# Altium schematic sheet STM32f042_schematic.SchDoc: Nucleo-STM32F042K6 Shield
size Letter; Organization: Ram Rohit Gannavarapu; Address1: Graduate Research Assistant; Address2: Systems Engineering Dept.; Address3: Colorado State University; Address4: Fort Collins, CO 80521; DocumentNumber: CAN |  ATECC608 | PWM; Revision: 1; SheetNumber: 1; SheetTotal: 1
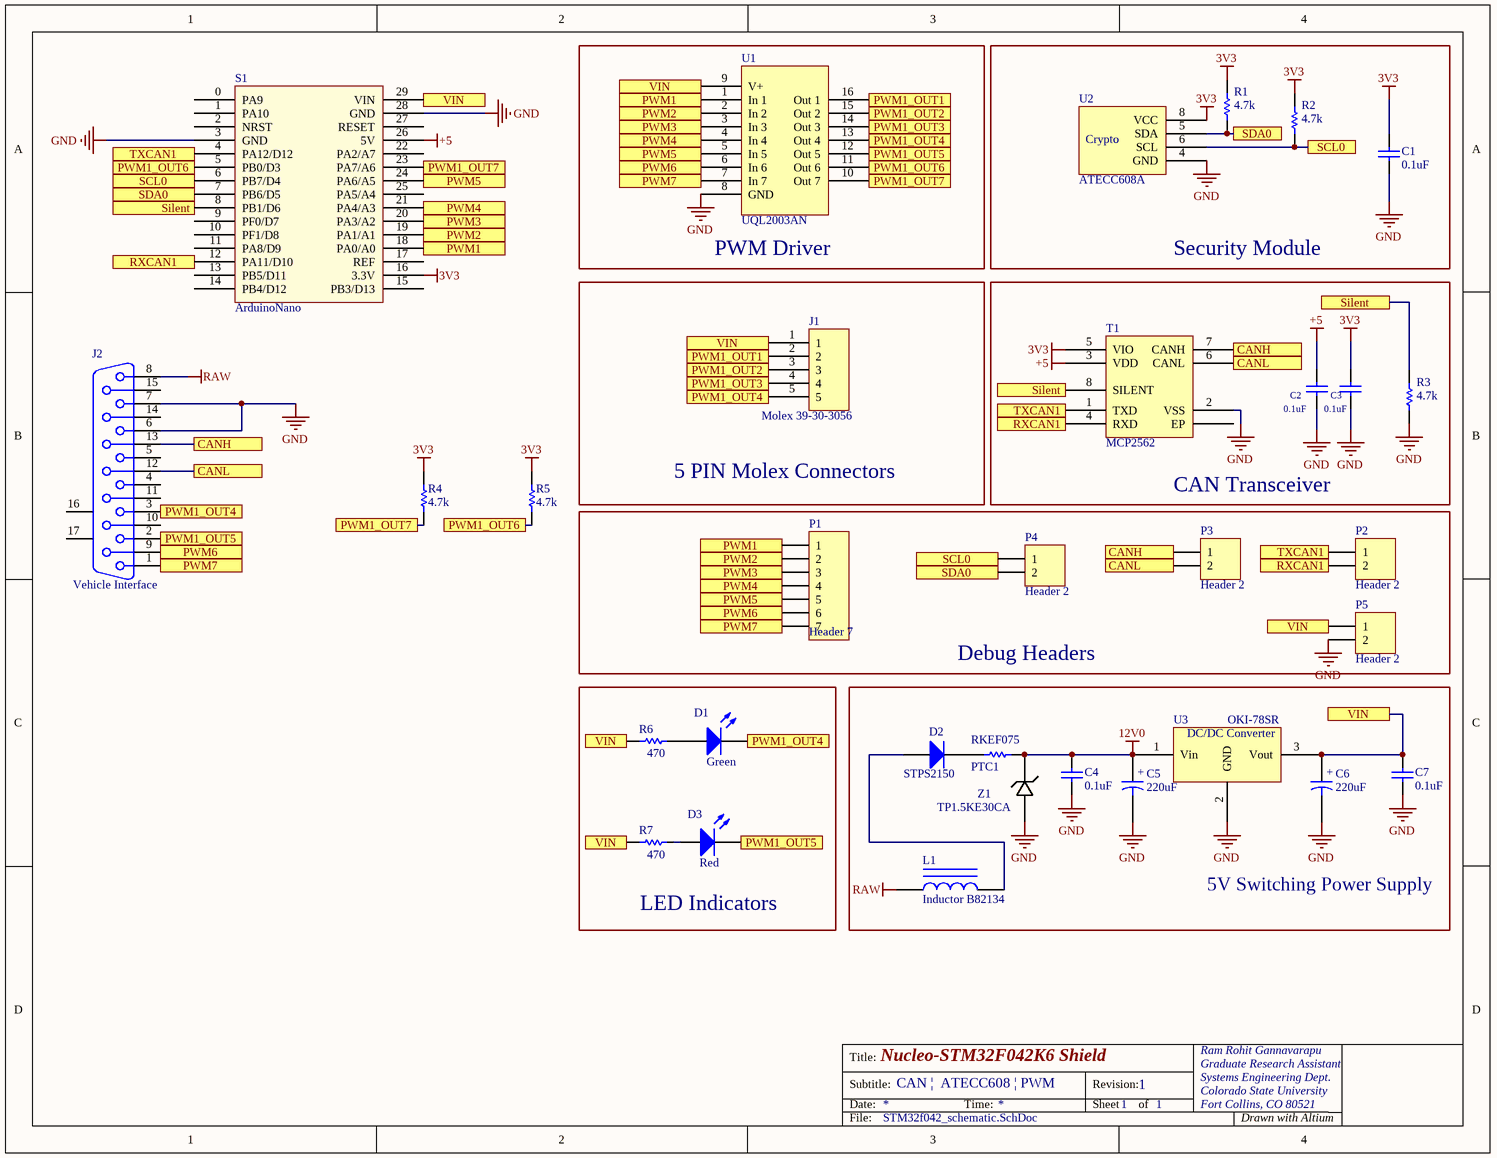
[diagram p0: STM32f042_schematic.SchDoc]

## Parts
C1  0.1uF  [CAPR5-4X5]
C2  0.1uF  [CAPR5-4X5]
C3  0.1uF  [CAPR5-4X5]
C4  0.1uF  [CAPR5-4X5]
C5  220uF  [Elec. Cap 5 x 10mm]
C6  220uF  [Elec. Cap 5 x 10mm]
C7  0.1uF  [CAPR5-4X5]
D1  Green  [5mm Rad LED]
D2  STPS2150  [DO-41]
D3  Red  [5mm Rad LED]
J1  Molex 39-30-3056  [5 POS MINI-FIT JR R/A Header]
J2  Vehicle Interface  [DB15]
L1  Inductor B82134  [AXIAL-0.9]
P1  Header 7  [HDR1X7]
P2  Header 2  [HDR1X2]
P3  Header 2  [HDR1X2]
P4  Header 2  [HDR1X2]
P5  Header 2  [HDR1X2]
PTC1  RKEF075  [PTC]
R1  4.7k  [AXIAL-0.4]
R2  4.7k  [AXIAL-0.4]
R3  4.7k  [AXIAL-0.4]
R4  4.7k  [Axial-0.4]
R5  4.7k  [Axial-0.4]
R6  470  [AXIAL-0.4]
R7  470  [AXIAL-0.4]
S1  ArduinoNano  [Arduino nano]
T1  MCP2562  [DIP-8]
U1  UQL2003AN  [DIP16]
U2  ATECC608A  [SOIC-8]
U3  OKI-78SR  [OKI-78SR]
Z1  TP1.5KE30CA  [DIODE-0.7]

## Blocks framed on the sheet
PWM Driver: U1
Security Module: C1 R1 R2 U2
5 PIN Molex Connectors: J1
CAN Transceiver: C2 C3 R3 T1
Debug Headers: P1-P5
LED Indicators: D1 D3 R6 R7
5V Switching Power Supply: C4-C7 D2 L1 PTC1 U3 Z1

## Ports
CANH, CANL, PWM1, PWM1_OUT1, PWM1_OUT2, PWM1_OUT3, PWM1_OUT4, PWM1_OUT5, PWM1_OUT6, PWM1_OUT7, PWM2, PWM3, PWM4, PWM5, PWM6, PWM7, RXCAN1, SCL0, SDA0, Silent, TXCAN1, VIN

## Nets
3V3: C1.2 C3.2 R1.1 R2.1 R4.2 R5.2 S1.16(3.3V) T1.5(VIO) U2.8(VCC)
12V0: C4.2 C5.1 PTC1.2 U3.1(Vin) Z1.2(K)
+5: C2.2 S1.26(5V) T1.3(VDD)
GND: C1.1 C2.1 C3.1 C4.1 C5.2(-) C6.2(-) C7.1 J2.6 J2.7 P5.2 R3.2 S1.3(GND) S1.28(GND) T1.2(VSS) U1.8(GND) U2.4(GND) U3.2(GND) Z1.1(A)
RAW: J2.8 L1.1
CANH: J2.13 P3.1 T1.7(CANH) ; port CANH
CANL: J2.12 P3.2 T1.6(CANL) ; port CANL
PWM1: P1.1 S1.18(PA0/A0) U1.1(In_1) ; port PWM1
PWM1_OUT1: J1.2 U1.16(Out_1) ; port PWM1_OUT1
PWM1_OUT2: J1.3 U1.15(Out_2) ; port PWM1_OUT2
PWM1_OUT3: J1.4 U1.14(Out_3) ; port PWM1_OUT3
PWM1_OUT4: D1.2(K) J1.5 J2.3 U1.13(Out_4) ; port PWM1_OUT4
PWM1_OUT5: D3.2(K) J2.2 U1.12(Out_5) ; port PWM1_OUT5
PWM1_OUT6: R5.1 S1.5(PB0/D3) U1.11(Out_6) ; port PWM1_OUT6
PWM1_OUT7: R4.1 S1.23(PA7/A6) U1.10(Out_7) ; port PWM1_OUT7
PWM2: P1.2 S1.19(PA1/A1) U1.2(In_2) ; port PWM2
PWM3: P1.3 S1.20(PA3/A2) U1.3(In_3) ; port PWM3
PWM4: P1.4 S1.21(PA4/A3) U1.4(In_4) ; port PWM4
PWM5: P1.5 S1.24(PA6/A5) U1.5(In_5) ; port PWM5
PWM6: J2.9 P1.6 U1.6(In_6) ; port PWM6
PWM7: J2.1 P1.7 U1.7(In_7) ; port PWM7
RXCAN1: P2.2 S1.12(PA11/D10) T1.4(RXD) ; port RXCAN1
SCL0: P4.1 R2.2 S1.6(PB7/D4) U2.6(SCL) ; port SCL0
SDA0: P4.2 R1.2 S1.7(PB6/D5) U2.5(SDA) ; port SDA0
Silent: R3.1 S1.8(PB1/D6) T1.8(SILENT) ; port Silent
TXCAN1: P2.1 S1.4(PA12/D12) T1.1(TXD) ; port TXCAN1
VIN: C6.1 C7.2 J1.1 P5.1 R6.1 R7.1 S1.29(VIN) U1.9(V+) U3.3(Vout) ; port VIN
NetD1_1: D1.1(A) R6.2
NetD2_1: D2.1(A) L1.2
NetD2_2: D2.2(K) PTC1.1
NetD3_1: D3.1(A) R7.2

Not connected (* = marked no-connect by the designer): J2 4 5 10 11 14 15 16(MH1) 17(MH2); S1 0(PA9) 1(PA10) 2(NRST) 9(PF0/D7) 10(PF1/D8) 11(PA8/D9) 13(PB5/D11) 14(PB4/D12) 15(PB3/D13) 17(REF) 22(PA2/A7) 25(PA5/A4) 27(RESET); T1 0(EP)

## Notes on the sheet
- Title:
- Subtitle:
- Date:
- Time:
- Revision:
- Sheet
- of
- File:
- Drawn with Altium
- (in symbol 7805) DC/DC Converter
- (in symbol ATECC508A) Crypto
- (in symbol Electrolytic Cap) +

## Library data of the parts
C1-C3 = Cap: 0.1µF ±10% 50V Ceramic Capacitor X7R Radial; Manufacturer: TDK Corporation; PartNumber: FA28X7R1H104KNU00; Alternative: Acceptable; Supplier 1: Digi-Key; Supplier Part Number 1: 445-175529-ND
C4 C7 = Cap: CAP CER 0.1UF 100V X7R RADIAL; Manufacturer: Vishay BC Components; PartNumber: K104K20X7RH53H5; Supplier 1: Digi-Key; Supplier Part Number 1: BC5139-ND
C5 C6 = Electrolytic Cap: 220µF 50V Aluminum Electrolytic Capacitors Radial, Can 175 mOhm @ 10kHz 5000 Hrs @ 105°C; Manufacturer: EPCOS (TDK); PartNumber: B41858C6227M000; Supplier 1: Digi-Key; Supplier Part Number 1: 495-6000-ND
D1 = LED - SMD: Green 569nm LED Indication - Discrete 2.1V Radial; Manufacturer: Lite-On Inc.; Supplier 1: Digi-Key; Supplier Part Number 1: 160-1130-ND; PartNumber: LTL-4233
D2 = Diode 1N4003: Diode Schottky 150V 2A Through Hole DO-15; Manufacturer: STMicroelectronics; PartNumber: STPS2150; Supplier 1: Digi-Key; Supplier Part Number 1: 497-3213-1-ND
D3 = LED - SMD: Red 623nm LED Indication - Discrete 2V Radial; Manufacturer: Lite-On Inc.; Supplier 1: Digi-Key; Supplier Part Number 1: 160-1127-ND; PartNumber: LTL-4223
J1 = 5 Pos Header: 5 Positions Header Connector 0.165" (4.20mm) Through Hole - Right Angle Tin; Manufacturer: Molex; Supplier 1: Digi-Key; PartNumber: 39-30-3055; Supplier Part Number 1: WM18448-ND
J2 = 788781-2: Receptacle Assembly, 15 Position, Right Angle, 8.08mm Series, Amplimite, with Screwlocks; Manufacturer: Amphenol FCI; PartNumber: D15S33E4GX00LF; Supplier 1: Digi-Key; Supplier Part Number 1: 609-1499-ND
L1 = Inductor Iron: Magnetic-Core Inductor; Manufacturer: TDK Electronics Inc.; PartNumber: B82134A5701M000; Supplier 1: Digi-Key; Supplier Part Number 1: 495-76036-1-ND
P1 = Header 7: Header, 7-Pin; LatestRevisionDate: 17-Jul-2002; LatestRevisionNote: Re-released for DXP Platform.; Publisher: Altium Limited
P2-P5 = Header 2: Header, 2-Pin; LatestRevisionDate: 17-Jul-2002; LatestRevisionNote: Re-released for DXP Platform.; Publisher: Altium Limited
PTC1 = SMD Resistor: Polymeric PTC Resettable Fuse 60V 750mA Ih Through Hole Radial, Disc; Manufacturer: Littelfuse Inc.; Supplier 1: Digi-Key; PartNumber: RKEF075; Supplier Part Number 1: RKEF075HF-ND
R1-R3 = Chip Resistor: 4.7 kOhms ±5% 0.25W, 1/4W Through Hole Resistor Axial Flame Retardant Coating, Safety Carbon Film; Manufacturer: Stackpole Electronics Inc; PartNumber: CF14JT4K70; Alternative: Acceptable; Supplier 1: Digi-Key; Supplier Part Number 1: CF14JT4K70CT-ND
R4 R5 = Chip Resistor: RES SMD 4.7K OHM 1% 1/10W 0603; Manufacturer: Yageo; PartNumber: CFR-25JB-52-4K7; Supplier 1: Digi-Key; Supplier Part Number 1: 4.7KQBK-ND
R6 R7 = Chip Resistor: 330 Ohms ±1% 0.1W, 1/10W Chip Resistor 0603 (1608 Metric) Automotive AEC-Q200, High Voltage Thick Film; Manufacturer: Stackpole Electronics Inc; PartNumber: CF14JT470R; Alternative: Acceptable; Supplier 1: Digi-Key; Supplier Part Number 1: CF14JT470RCT-ND
T1 = MCP2558FD: Microchip CAN FD Transceiver with Silent Mode; PartNumber: MCP2562-E/P; Manufacturer: Microchip; Supplier 1: Digi-Key; Supplier Part Number 1: MCP2562-E/P-ND
U1 = ULQ2003: High voltage, high current Darlington arrays each containing seven open collector Darlington pairswith common emitters.
U2 = ATECC508A: Authentication Chip IC Networking and Communications 8-SOIC; Manufacturer: Microchip Technology; PartNumber: ATECC608A-SSHDA-T; Supplier Part Number 1: ATECC608A-SSHDA-TCT-ND; Supplier 1: Digi-Key
U3 = 7805: 5V DC/DC Converter (7805 replacement); Manufacturer: Murata Power Solutions Inc.; PartNumber: OKI-78SR-5/1.5-W36H-C; Supplier 1: Digi-Key; Supplier Part Number 1: 811-2692-ND
Z1 = Zener: TVS DIODE 25.6V 41.4V DO201; Manufacturer: Littelfuse Inc.; Supplier 1: Digi-Key; Supplier Part Number 1: F7610CT-ND; PartNumber: TP1.5KE30CA